# EAGLE design stepper_w_2_input_bitsB (EAGLE 6.4)
stepper conroller with 2 counting bits for unipolar stepper motor
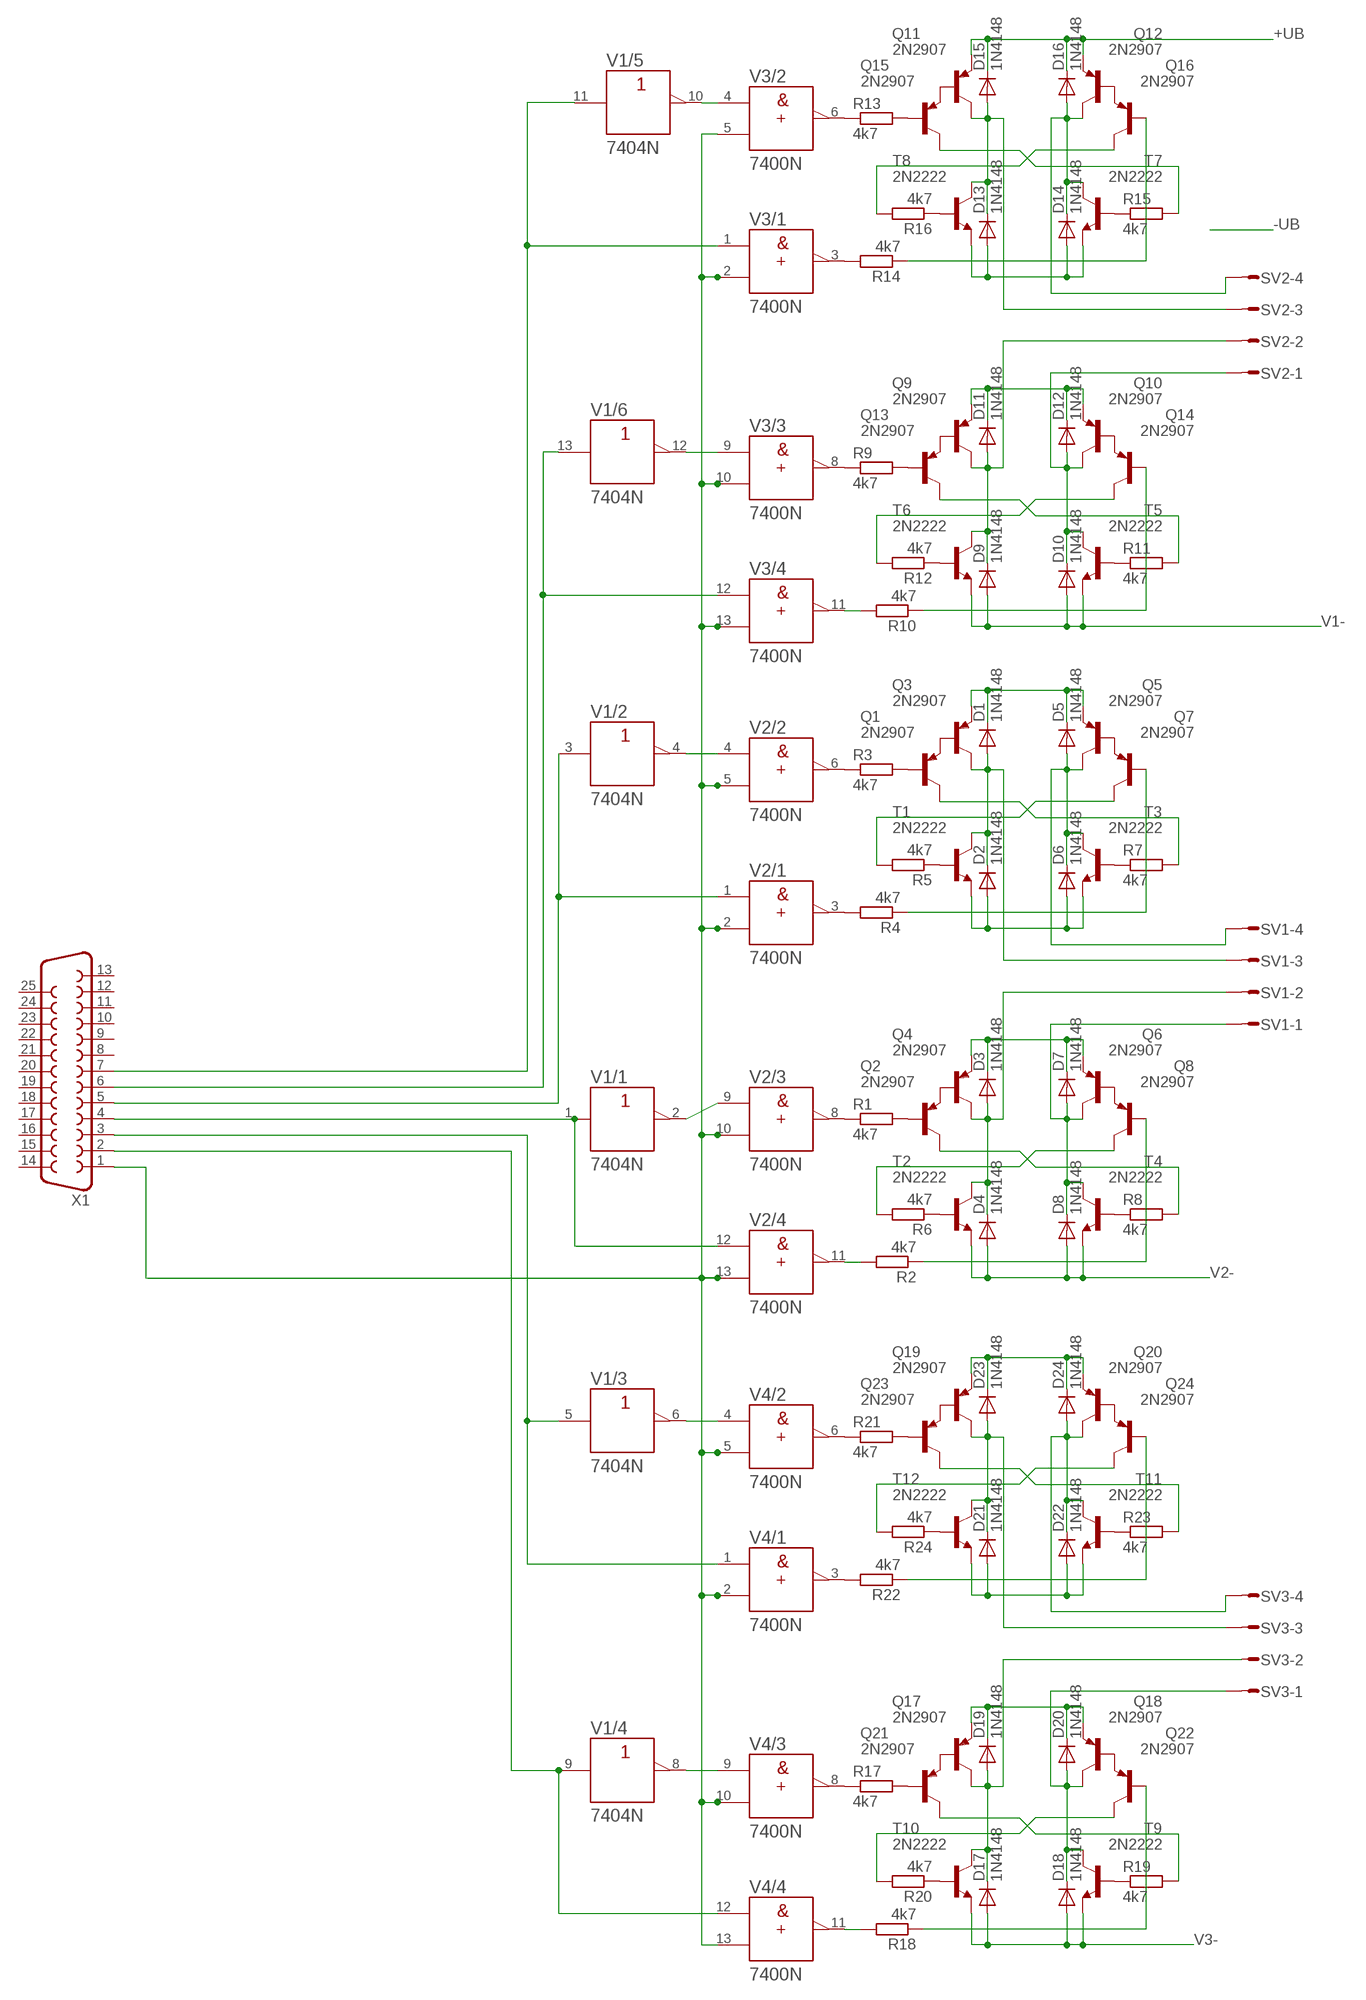
[diagram p0: schematic, sheet 1]

## Parts
D1  1N4148  DIODE-D-2.5  [D-2.5]
D2  1N4148  DIODE-D-2.5  [D-2.5]
D3  1N4148  DIODE-D-2.5  [D-2.5]
D4  1N4148  DIODE-D-2.5  [D-2.5]
D5  1N4148  DIODE-D-2.5  [D-2.5]
D6  1N4148  DIODE-D-2.5  [D-2.5]
D7  1N4148  DIODE-D-2.5  [D-2.5]
D8  1N4148  DIODE-D-2.5  [D-2.5]
D9  1N4148  DIODE-D-2.5  [D-2.5]
D10  1N4148  DIODE-D-2.5  [D-2.5]
D11  1N4148  DIODE-D-2.5  [D-2.5]
D12  1N4148  DIODE-D-2.5  [D-2.5]
D13  1N4148  DIODE-D-2.5  [D-2.5]
D14  1N4148  DIODE-D-2.5  [D-2.5]
D15  1N4148  DIODE-D-2.5  [D-2.5]
D16  1N4148  DIODE-D-2.5  [D-2.5]
D17  1N4148  DIODE-D-2.5  [D-2.5]
D18  1N4148  DIODE-D-2.5  [D-2.5]
D19  1N4148  DIODE-D-2.5  [D-2.5]
D20  1N4148  DIODE-D-2.5  [D-2.5]
D21  1N4148  DIODE-D-2.5  [D-2.5]
D22  1N4148  DIODE-D-2.5  [D-2.5]
D23  1N4148  DIODE-D-2.5  [D-2.5]
D24  1N4148  DIODE-D-2.5  [D-2.5]
Q1  2N2907  [TO18]
Q2  2N2907  [TO18]
Q3  2N2907  [TO18]
Q4  2N2907  [TO18]
Q5  2N2907  [TO18]
Q6  2N2907  [TO18]
Q7  2N2907  [TO18]
Q8  2N2907  [TO18]
Q9  2N2907  [TO18]
Q10  2N2907  [TO18]
Q11  2N2907  [TO18]
Q12  2N2907  [TO18]
Q13  2N2907  [TO18]
Q14  2N2907  [TO18]
Q15  2N2907  [TO18]
Q16  2N2907  [TO18]
Q17  2N2907  [TO18]
Q18  2N2907  [TO18]
Q19  2N2907  [TO18]
Q20  2N2907  [TO18]
Q21  2N2907  [TO18]
Q22  2N2907  [TO18]
Q23  2N2907  [TO18]
Q24  2N2907  [TO18]
R1  4k7  R-EU_0204/7  [0204/7]
R2  4k7  R-EU_0207/10  [0207/10]
R3  4k7  R-EU_0207/10  [0207/10]
R4  4k7  R-EU_0207/10  [0207/10]
R5  4k7  R-EU_0207/10  [0207/10]
R6  4k7  R-EU_0207/10  [0207/10]
R7  4k7  R-EU_0207/10  [0207/10]
R8  4k7  R-EU_0207/10  [0207/10]
R9  4k7  R-EU_0204/7  [0204/7]
R10  4k7  R-EU_0207/10  [0207/10]
R11  4k7  R-EU_0207/10  [0207/10]
R12  4k7  R-EU_0207/10  [0207/10]
R13  4k7  R-EU_0207/10  [0207/10]
R14  4k7  R-EU_0207/10  [0207/10]
R15  4k7  R-EU_0207/10  [0207/10]
R16  4k7  R-EU_0207/10  [0207/10]
R17  4k7  R-EU_0204/7  [0204/7]
R18  4k7  R-EU_0207/10  [0207/10]
R19  4k7  R-EU_0207/10  [0207/10]
R20  4k7  R-EU_0207/10  [0207/10]
R21  4k7  R-EU_0207/10  [0207/10]
R22  4k7  R-EU_0207/10  [0207/10]
R23  4k7  R-EU_0207/10  [0207/10]
R24  4k7  R-EU_0207/10  [0207/10]
SV1  S04P  [S04P]
SV2  S04P  [S04P]
SV3  S04P  [S04P]
T1  2N2222  [TO18]
T2  2N2222  [TO18]
T3  2N2222  [TO18]
T4  2N2222  [TO18]
T5  2N2222  [TO18]
T6  2N2222  [TO18]
T7  2N2222  [TO18]
T8  2N2222  [TO18]
T9  2N2222  [TO18]
T10  2N2222  [TO18]
T11  2N2222  [TO18]
T12  2N2222  [TO18]
V1  7404N  [DIL14]
V2  7400N  [DIL14]
V3  7400N  [DIL14]
V4  7400N  [DIL14]
X1  F25HP  [F25HP]

## Nets
+UB: D1.C D3.C D5.C D7.C D11.C D12.C D15.C D16.C D19.C D20.C D23.C D24.C Q3.1(E) Q4.1(E) Q5.1(E) Q6.1(E) Q9.1(E) Q10.1(E) Q11.1(E) Q12.1(E) Q17.1(E) Q18.1(E) Q19.1(E) Q20.1(E)
N$1: R6.1 T2.2(B)
N$2: Q8.3(C) R6.2
N$3: R8.1 T4.2(B)
N$4: Q2.2(B) R1.2
N$5: Q8.2(B) R2.1
N$6: Q2.1(E) Q4.2(B)
N$7: Q2.3(C) R8.2
N$8: Q6.2(B) Q8.1(E)
N$9: D3.A D4.C Q4.3(C) SV1.2 T2.3(C)
N$10: D7.A D8.C Q6.3(C) SV1.1 T4.3(C)
N$11: R1.1 V2.8(/3:Y)
N$12: R2.2 V2.11(/4:Y)
N$13: Q7.3(C) R5.2
N$14: V1.4(/2:Y) V2.4(/2:A)
N$15: Q7.2(B) R4.1
N$16: R5.1 T1.2(B)
N$17: Q1.3(C) R7.2
N$18: R7.1 T3.2(B)
N$19: D1.A D2.C Q3.3(C) SV1.3 T1.3(C)
N$20: D5.A D6.C Q5.3(C) SV1.4 T3.3(C)
N$21: Q1.1(E) Q3.2(B)
N$22: Q5.2(B) Q7.1(E)
N$23: R4.2 V2.3(/1:Y)
N$24: R3.1 V2.6(/2:Y)
N$25: V1.3(/2:A) V2.1(/1:A) X1.5
N$26: Q1.2(B) R3.2
N$27: V1.2(/1:Y) V2.9(/3:A)
N$28: V1.1(/1:A) V2.12(/4:A) X1.4
N$29: Q14.3(C) R12.2
N$30: Q14.2(B) R10.1
N$31: Q13.3(C) R11.2
N$32: D9.C D11.A Q9.3(C) SV2.2 T6.3(C)
N$33: D10.C D12.A Q10.3(C) SV2.1 T5.3(C)
N$34: R9.1 V3.8(/3:Y)
N$35: R10.2 V3.11(/4:Y)
N$36: Q16.3(C) R16.2
N$37: Q16.2(B) R14.1
N$38: Q15.3(C) R15.2
N$39: D13.C D15.A Q11.3(C) SV2.3 T8.3(C)
N$40: D14.C D16.A Q12.3(C) SV2.4 T7.3(C)
N$41: R14.2 V3.3(/1:Y)
N$42: R13.1 V3.6(/2:Y)
N$43: R12.1 T6.2(B)
N$44: R11.1 T5.2(B)
N$45: Q9.2(B) Q13.1(E)
N$46: Q10.2(B) Q14.1(E)
N$47: R16.1 T8.2(B)
N$48: R15.1 T7.2(B)
N$49: Q11.2(B) Q15.1(E)
N$50: Q12.2(B) Q16.1(E)
N$51: Q15.2(B) R13.2
N$52: V1.10(/5:Y) V3.4(/2:A)
N$53: V1.11(/5:A) V3.1(/1:A) X1.7
N$54: Q22.3(C) R20.2
N$55: V1.13(/6:A) V3.12(/4:A) X1.6
N$56: Q13.2(B) R9.2
N$57: Q22.2(B) R18.1
N$58: Q21.3(C) R19.2
N$59: D17.C D19.A Q17.3(C) T10.3(C)
N$60: D18.C D20.A Q18.3(C) SV3.1 T9.3(C)
N$61: R17.1 V4.8(/3:Y)
N$62: R18.2 V4.11(/4:Y)
N$63: Q24.3(C) R24.2
N$64: Q24.2(B) R22.1
N$65: Q23.3(C) R23.2
N$66: D21.C D23.A Q19.3(C) SV3.3 T12.3(C)
N$67: D22.C D24.A Q20.3(C) SV3.4 T11.3(C)
N$68: R22.2 V4.3(/1:Y)
N$69: R21.1 V4.6(/2:Y)
N$70: R20.1 T10.2(B)
N$71: R19.1 T9.2(B)
N$72: Q17.2(B) Q21.1(E)
N$73: Q18.2(B) Q22.1(E)
N$74: R24.1 T12.2(B)
N$75: R23.1 T11.2(B)
N$76: Q19.2(B) Q23.1(E)
N$77: Q20.2(B) Q24.1(E)
N$78: Q23.2(B) R21.2
N$79: V1.6(/3:Y) V4.4(/2:A)
N$80: V1.5(/3:A) V4.1(/1:A) X1.3
N$81: V1.12(/6:Y) V3.9(/3:A)
N$82: V1.9(/4:A) V4.12(/4:A) X1.2
N$83: Q21.2(B) R17.2
N$85: V1.8(/4:Y) V4.9(/3:A)
STROBE: V2.2(/1:B) V2.5(/2:B) V2.10(/3:B) V2.13(/4:B) V3.2(/1:B) V3.5(/2:B) V3.10(/3:B) V3.13(/4:B) V4.2(/1:B) V4.5(/2:B) V4.10(/3:B) V4.13(/4:B) X1.1
V1-: D9.A D10.A D13.A D14.A T5.1(E) T6.1(E) T7.1(E) T8.1(E)
V2-: D2.A D4.A D6.A D8.A T1.1(E) T2.1(E) T3.1(E) T4.1(E)
V3-: D17.A D18.A D21.A D22.A T9.1(E) T10.1(E) T11.1(E) T12.1(E)
Unconnected: SV3.2 X1.8 X1.9 X1.10 X1.11 X1.12 X1.13 X1.14 X1.15 X1.16 X1.17 X1.18 X1.19 X1.20 X1.21 X1.22 X1.23 X1.24 X1.25

## Power pins joined to a net without a drawn wire
+UB: V1.14(/+UB:+UB) V2.14(/+UB:+UB) V3.14(/+UB:+UB) V4.14(/+UB:+UB)
-UB: V1.7(/-UB:-UB) V2.7(/-UB:-UB) V3.7(/-UB:-UB) V4.7(/-UB:-UB)

## Library data of the parts
D1-D24 = diode:DIODE-: DIODE
Q1-Q24 = transistor-pnp:2N2907*: PNP Transistor
R1-R24 = rcl:R-EU_: RESISTOR, European symbol
SV1-SV3 = con-amp-mt:S04P: AMP MT CONNECTOR; OC_FARNELL: unknown; OC_NEWARK: unknown
T1-T12 = transistor:2N2222: NPN TRANSISTOR
V1 = 74ttl-din:74*04: Hex INVERTER
V2-V4 = 74ttl-din:74*00: Quad 2-input NAND gate
X1 = con-subd:F25: SUB-D; OC_FARNELL: unknown; OC_NEWARK: unknown

## Board
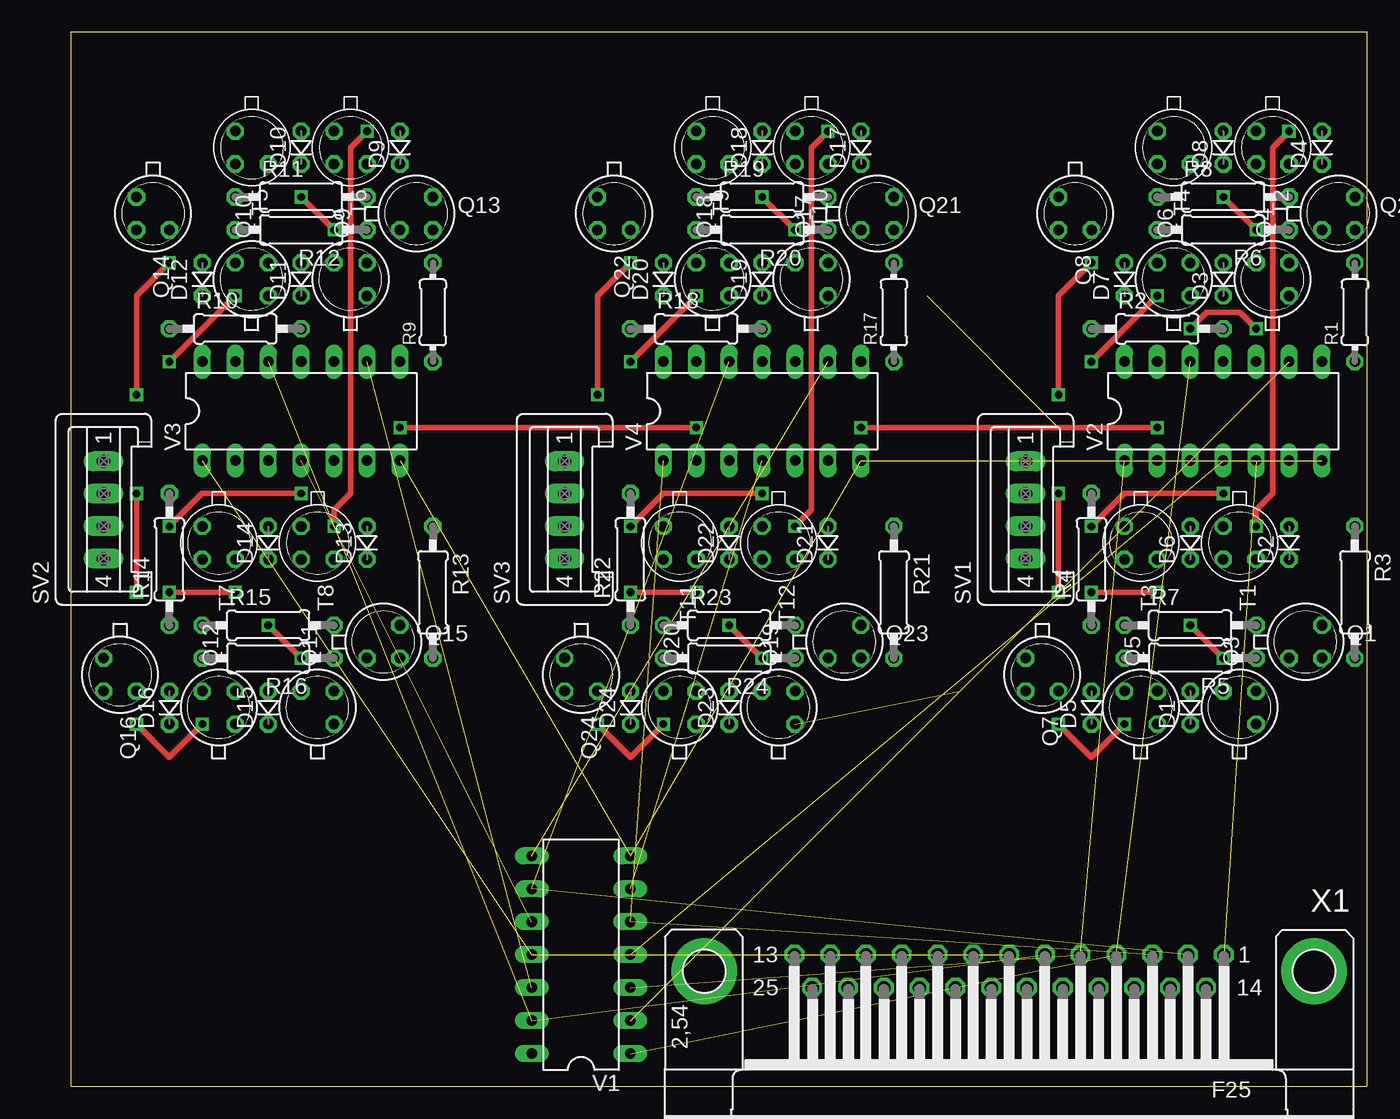
[diagram p1: board, top side]
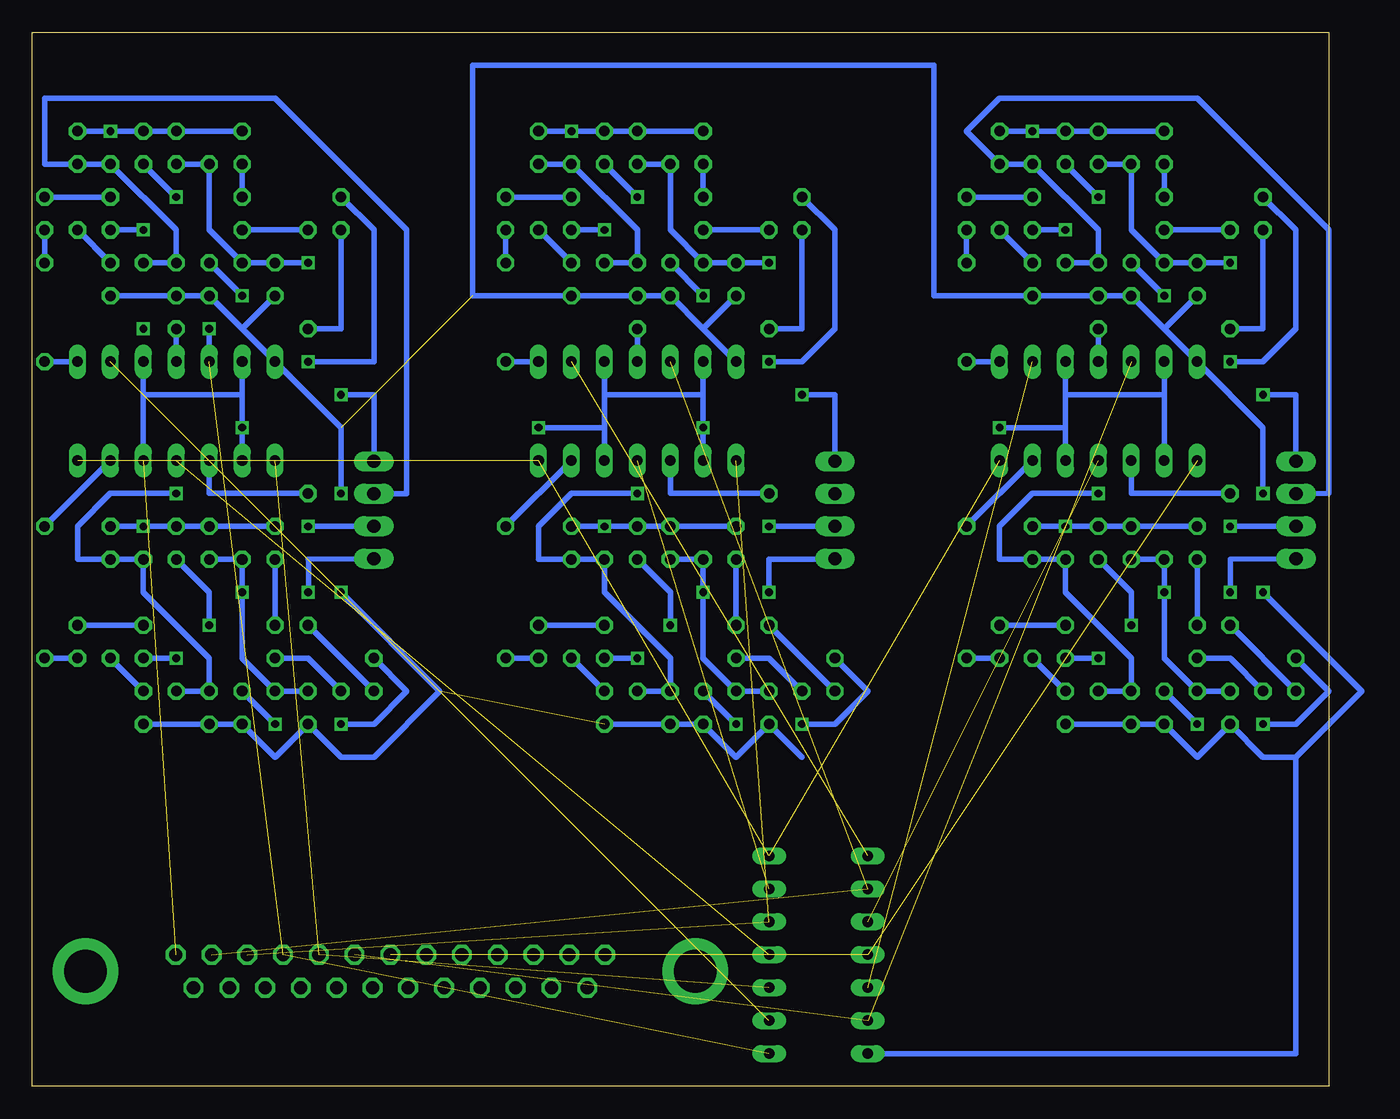
[diagram p2: board, bottom side, seen from below]

Size 100 x 81.27 mm. Coordinates in mm from the lower left corner, seen from the top.
Outline: 0,0 100,0 100,81.27 0,81.27 0,0
Copper layers (1*16): Top 0.035mm / dielectric 1.5mm / Bottom 0.035mm
Design rules "default": minimum track width 10mil, minimum drill 24mil, track to track 8mil, track to pad 8mil, pad to pad 8mil, via to via 8mil, smd to smd 8mil, copper to edge 40mil, drill to drill 8mil, minimum pad ring 10mil, minimum via ring 8mil, stop-mask expansion 4mil, vias tented up to drill 0mil, thermal gap 10mil

### Footprints (pad centres in the part's own frame; a part is rotated, then mirrored left to right if it is on the bottom)
D-2.5 = drill 0.813 octagon: A 1.27,0; C -1.27,0
TO18 = drill 0.813 octagon: 1 -1.27,-1.27; 2 1.27,-1.27; 3 1.27,1.27
0204/7 = drill 0.813 octagon: 1 -3.81,0; 2 3.81,0
0207/10 = drill 0.813 octagon: 1 -5.08,0; 2 5.08,0
S04P = drill 1.016 long: 1 3.75,0; 2 1.25,0; 3 -1.25,0; 4 -3.75,0
DIL14 = drill 0.813 long: 1 -7.62,-3.81; 2 -5.08,-3.81; 3 -2.54,-3.81; 4 0,-3.81; 5 2.54,-3.81; 6 5.08,-3.81; 7 7.62,-3.81; 8 7.62,3.81; 9 5.08,3.81; 10 2.54,3.81; 11 0,3.81; 12 -2.54,3.81; 13 -5.08,3.81; 14 -7.62,3.81
F25HP = drill 1.016 octagon: 1 -16.561,-1.27; 2 -13.792,-1.27; 3 -11.049,-1.27; 4 -8.28,-1.27; 5 -5.512,-1.27; 6 -2.769,-1.27; 7 0,-1.27; 8 2.769,-1.27; 9 5.512,-1.27; 10 8.28,-1.27; 11 11.049,-1.27; 12 13.792,-1.27; 13 16.561,-1.27; 14 -15.189,1.27; 15 -12.421,1.27; 16 -9.652,1.27; 17 -6.909,1.27; 18 -4.14,1.27; 19 -1.372,1.27; 20 1.372,1.27; 21 4.14,1.27; 22 6.909,1.27; 23 9.652,1.27; 24 12.421,1.27; 25 15.189,1.27 | drill 3.302 pad 5.08: G1 -23.52,0; G2 23.52,0

### Placement (x,y rotation side)
D1  86.36,29.21 90 top
D2  93.98,41.91 90 top
D3  88.9,62.23 90 top
D4  96.52,72.39 90 top
D5  78.74,29.21 90 top
D6  86.36,41.91 90 top
D7  81.28,62.23 90 top
D8  88.9,72.39 90 top
D9  25.4,72.39 90 top
D10  17.78,72.39 90 top
D11  17.78,62.23 90 top
D12  10.16,62.23 90 top
D13  22.86,41.91 90 top
D14  15.24,41.91 90 top
D15  15.24,29.21 90 top
D16  7.62,29.21 90 top
D17  60.96,72.39 90 top
D18  53.34,72.39 90 top
D19  53.34,62.23 90 top
D20  45.72,62.23 90 top
D21  58.42,41.91 90 top
D22  50.8,41.91 90 top
D23  50.8,29.21 90 top
D24  43.18,29.21 90 top
Q1  95.25,34.29 0 top
Q2  97.79,67.31 0 top
Q3  90.17,29.21 90 top
Q4  92.71,62.23 90 top
Q5  82.55,29.21 90 top
Q6  85.09,62.23 90 top
Q7  74.93,31.75 270 top
Q8  77.47,67.31 270 top
Q9  21.59,62.23 90 top
Q10  13.97,62.23 90 top
Q11  19.05,29.21 90 top
Q12  11.43,29.21 90 top
Q13  26.67,67.31 0 top
Q14  6.35,67.31 270 top
Q15  24.13,34.29 0 top
Q16  3.81,31.75 270 top
Q17  57.15,62.23 90 top
Q18  49.53,62.23 90 top
Q19  54.61,29.21 90 top
Q20  46.99,29.21 90 top
Q21  62.23,67.31 0 top
Q22  41.91,67.31 270 top
Q23  59.69,34.29 0 top
Q24  39.37,31.75 270 top
R1  99.06,59.69 90 top
R2  83.82,58.42 0 top
R3  99.06,38.1 270 top
R4  78.74,40.64 90 top
R5  86.36,33.02 180 top
R6  88.9,66.04 180 top
R7  86.36,35.56 0 top
R8  88.9,68.58 0 top
R9  27.94,59.69 90 top
R10  12.7,58.42 0 top
R11  17.78,68.58 0 top
R12  17.78,66.04 180 top
R13  27.94,38.1 270 top
R14  7.62,40.64 90 top
R15  15.24,35.56 0 top
R16  15.24,33.02 180 top
R17  63.5,59.69 90 top
R18  48.26,58.42 0 top
R19  53.34,68.58 0 top
R20  53.34,66.04 180 top
R21  63.5,38.1 270 top
R22  43.18,40.64 90 top
R23  50.8,35.56 0 top
R24  50.8,33.02 180 top
SV1  73.66,44.45 90 top
SV2  2.54,44.45 90 top
SV3  38.1,44.45 90 top
T1  90.17,41.91 270 top
T2  92.71,72.39 270 top
T3  82.55,41.91 270 top
T4  85.09,72.39 270 top
T5  13.97,72.39 270 top
T6  21.59,72.39 270 top
T7  11.43,41.91 270 top
T8  19.05,41.91 270 top
T9  49.53,72.39 270 top
T10  57.15,72.39 270 top
T11  46.99,41.91 270 top
T12  54.61,41.91 270 top
V1  39.37,10.16 90 top
V2  88.9,52.07 0 top
V3  17.78,52.07 0 top
V4  53.34,52.07 0 top
X1  72.39,8.89 180 top

### Tracks (layer width: path | path; a pad name or v marks a point on that pad's centre or on a via)
+UB  (via drill 0.6)  (2 unrouted)
  Top 0.406: v76.2,45.72 v76.2,38.1 | v5.08,38.1 v5.08,45.72
  Bottom 0.406: D1.C Q3.1 Q5.1 81.28,25.4 D5.C 76.2,25.4 73.66,25.4 68.58,30.48 v76.2,38.1 | Q4.1 D3.C Q6.1 83.82,58.42 | D7.C 83.82,58.42 | 83.82,58.42 V2.14 76.2,50.8 v76.2,45.72 | D12.C 12.7,58.42 | 12.7,58.42 Q10.1 D11.C Q9.1 30.48,60.96 30.48,78.74 66.04,78.74 66.04,60.96 Q17.1 D19.C Q18.1 48.26,58.42 | Q11.1 D15.C Q12.1 10.16,25.4 D16.C 5.08,25.4 2.54,25.4 | 2.54,25.4 -2.54,30.48 v5.08,38.1 | v5.08,45.72 5.08,50.8 V3.14 12.7,58.42 | D20.C 48.26,58.42 | 48.26,58.42 V4.14 | Q19.1 D23.C Q20.1 45.72,25.4 D24.C 40.64,25.4 | V1.14 2.54,2.54 2.54,25.4
-UB  (3 unrouted)
N$1  (via drill 0.6)
  Top 0.406: v91.44,66.04 v88.9,68.58
  Bottom 0.406: R6.1 v91.44,66.04 | v88.9,68.58 T2.2
N$2
  Bottom 0.406: Q8.3 R6.2
N$3
  Bottom 0.406: R8.1 T4.2
N$4
  Bottom 0.406: R1.2 Q2.2
N$5
  Bottom 0.406: Q8.2 76.2,58.42 R2.1
N$6
  Bottom 0.406: Q4.2 Q2.1
N$7
  Bottom 0.406: Q2.3 R8.2
N$8  (via drill 0.6)
  Top 0.406: v83.82,60.96 v78.74,55.88
  Bottom 0.406: v78.74,55.88 73.66,55.88 73.66,66.04 Q8.1 | Q6.2 v83.82,60.96
N$9
  Bottom 0.406: Q4.3 D3.A 88.9,66.04 T2.3 D4.C 99.06,71.12 99.06,76.2 81.28,76.2 71.12,66.04 71.12,45.72 71.14,45.7 SV1.2
N$10  (via drill 0.6)
  Top 0.406: v78.74,63.5 76.2,60.96 v76.2,53.34
  Bottom 0.406: D8.C T4.3 86.36,66.04 Q6.3 D7.A v78.74,63.5 | v76.2,53.34 73.66,53.34 SV1.1
N$11
  Bottom 0.406: R1.1 V2.8
N$12
  Bottom 0.406: V2.11 R2.2
N$13
  Bottom 0.406: Q7.3 78.74,33.02 R5.2
N$14  (1 unrouted)
N$15
  Bottom 0.406: R4.1 Q7.2
N$16  (via drill 0.6)
  Top 0.406: v88.9,33.02 v86.36,35.56
  Bottom 0.406: R5.1 v88.9,33.02 | v86.36,35.56 86.36,38.1 T1.2
N$17
  Bottom 0.406: Q1.3 R7.2
N$18
  Bottom 0.406: R7.1 T3.2
N$19  (via drill 0.6)
  Top 0.406: v78.74,43.18 81.28,45.72 v88.9,45.72
  Bottom 0.406: Q3.3 D1.A 86.36,33.02 91.44,38.1 T1.3 D2.C 96.52,40.64 96.52,43.18 93.98,45.72 v88.9,45.72 | SV1.3 76.18,43.2 v78.74,43.18
N$20  (via drill 0.6)
  Top 0.406: v78.74,38.1 v83.82,38.1
  Bottom 0.406: D5.A Q5.3 83.82,33.02 v83.82,38.1 T3.3 D6.C | SV1.4 78.74,40.64 78.68,40.58 78.68,38.16 v78.74,38.1
N$21
  Bottom 0.406: Q3.2 Q1.1
N$22  (via drill 0.6)
  Top 0.406: v81.28,27.94 78.74,25.4 v76.2,27.94
  Bottom 0.406: Q5.2 v81.28,27.94 | Q7.1 71.12,30.48 73.66,27.94 v76.2,27.94
N$23
  Bottom 0.406: R4.2 86.36,45.72 V2.3
N$24
  Bottom 0.406: R3.1 V2.6
N$25  (2 unrouted)
N$26
  Bottom 0.406: R3.2 Q1.2
N$27  (1 unrouted)
N$28  (via drill 0.6)  (2 unrouted)
  Top 0.406: v91.44,58.42 90.17,59.69 87.63,59.69 v86.36,58.42
  Bottom 0.406: v86.36,58.42 V2.12
N$29
  Bottom 0.406: Q14.3 R12.2
N$30
  Bottom 0.406: Q14.2 5.08,58.42 R10.1
N$31
  Bottom 0.406: Q13.3 R11.2
N$32
  Bottom 0.406: Q9.3 D11.A 17.78,66.04 T6.3 D9.C 27.94,73.66 25.4,76.2 10.16,76.2 0,66.04 0,45.72 SV2.2
N$33  (via drill 0.6)
  Top 0.406: v5.08,53.34 5.08,60.96 v7.62,63.5
  Bottom 0.406: D10.C T5.3 15.24,66.04 Q10.3 D12.A v7.62,63.5 | SV2.1 2.54,53.34 v5.08,53.34
N$34
  Bottom 0.406: R9.1 V3.8
N$35
  Bottom 0.406: R10.2 V3.11
N$36
  Bottom 0.406: Q16.3 7.62,33.02 R16.2
N$37
  Bottom 0.406: Q16.2 R14.1
N$38
  Bottom 0.406: R15.2 Q15.3
N$39  (via drill 0.6)
  Top 0.406: v7.62,43.18 10.16,45.72 v17.78,45.72
  Bottom 0.406: Q11.3 D15.A 15.24,33.02 20.32,38.1 T8.3 D13.C 25.4,40.64 25.4,43.18 22.86,45.72 v17.78,45.72 | SV2.3 v7.62,43.18
N$40  (via drill 0.6)
  Top 0.406: v7.62,38.1 v12.7,38.1
  Bottom 0.406: D16.A Q12.3 12.7,33.02 v12.7,38.1 T7.3 D14.C | SV2.4 7.62,40.64 v7.62,38.1
N$41
  Bottom 0.406: R14.2 15.24,45.72 V3.3
N$42
  Bottom 0.406: R13.1 V3.6
N$43  (via drill 0.6)
  Top 0.406: v17.78,68.58 v20.32,66.04
  Bottom 0.406: T6.2 v17.78,68.58 | v20.32,66.04 R12.1
N$44
  Bottom 0.406: R11.1 T5.2
N$45
  Bottom 0.406: Q13.1 Q9.2
N$46  (via drill 0.6)
  Top 0.406: v7.62,55.88 v12.7,60.96
  Bottom 0.406: Q14.1 2.54,66.04 2.54,58.42 5.08,55.88 v7.62,55.88 | v12.7,60.96 Q10.2
N$47  (via drill 0.6)
  Top 0.406: v15.24,35.56 v17.78,33.02
  Bottom 0.406: T8.2 15.24,38.1 v15.24,35.56 | v17.78,33.02 R16.1
N$48
  Bottom 0.406: R15.1 T7.2
N$49
  Bottom 0.406: Q11.2 Q15.1
N$50  (via drill 0.6)
  Top 0.406: v5.08,27.94 7.62,25.4 v10.16,27.94
  Bottom 0.406: Q16.1 0,30.48 2.54,27.94 v5.08,27.94 | v10.16,27.94 Q12.2
N$51
  Bottom 0.406: Q15.2 R13.2
N$52  (1 unrouted)
N$53  (2 unrouted)
N$54
  Bottom 0.406: Q22.3 R20.2
N$55  (2 unrouted)
N$56
  Bottom 0.406: Q13.2 R9.2
N$57
  Bottom 0.406: Q22.2 40.64,58.42 R18.1
N$58
  Bottom 0.406: R19.2 Q21.3
N$59
  Bottom 0.406: D17.C T10.3 53.34,66.04 D19.A Q17.3
N$60  (via drill 0.6)
  Top 0.406: v43.18,63.5 40.64,60.96 v40.64,53.34
  Bottom 0.406: D18.C T9.3 50.8,66.04 Q18.3 D20.A v43.18,63.5 | v40.64,53.34 38.1,53.34 SV3.1
N$61
  Bottom 0.406: V4.8 R17.1
N$62
  Bottom 0.406: R18.2 V4.11
N$63
  Bottom 0.406: Q24.3 43.18,33.02 R24.2
N$64
  Bottom 0.406: R22.1 Q24.2
N$65
  Bottom 0.406: Q23.3 R23.2
N$66  (via drill 0.6)
  Top 0.406: v43.18,43.18 45.72,45.72 v53.34,45.72
  Bottom 0.406: Q19.3 D23.A 50.8,33.02 55.88,38.1 T12.3 D21.C 60.96,40.64 60.96,43.18 58.42,45.72 v53.34,45.72 | SV3.3 43.16,43.2 v43.18,43.18
N$67  (via drill 0.6)
  Top 0.406: v48.26,38.1 v43.18,38.1
  Bottom 0.406: D22.C T11.3 v48.26,38.1 48.26,33.02 Q20.3 D24.A | v43.18,38.1 43.18,40.64 38.1,40.64 SV3.4
N$68
  Bottom 0.406: V4.3 50.8,45.72 R22.2
N$69
  Bottom 0.406: R21.1 V4.6
N$70  (via drill 0.6)
  Top 0.406: v53.34,68.58 v55.88,66.04
  Bottom 0.406: T10.2 v53.34,68.58 | v55.88,66.04 R20.1
N$71
  Bottom 0.406: T9.2 R19.1
N$72
  Bottom 0.406: Q21.1 Q17.2
N$73  (via drill 0.6)
  Top 0.406: v43.18,55.88 v48.26,60.96
  Bottom 0.406: Q22.1 38.1,66.04 38.1,58.42 40.64,55.88 v43.18,55.88 | v48.26,60.96 Q18.2
N$74  (via drill 0.6)
  Top 0.406: v53.34,33.02 v50.8,35.56
  Bottom 0.406: R24.1 v53.34,33.02 | v50.8,35.56 50.8,38.1 T12.2
N$75
  Bottom 0.406: R23.1 T11.2
N$76
  Bottom 0.406: Q19.2 Q23.1
N$77  (via drill 0.6)
  Top 0.406: v40.64,27.94 43.18,25.4 v45.72,27.94
  Bottom 0.406: Q24.1 35.56,30.48 38.1,27.94 v40.64,27.94 | v45.72,27.94 Q20.2
N$78
  Bottom 0.406: Q23.2 R21.2
N$79  (1 unrouted)
N$80  (2 unrouted)
N$81  (1 unrouted)
N$82  (2 unrouted)
N$83
  Bottom 0.406: Q21.2 R17.2
N$85  (1 unrouted)
STROBE  (via drill 0.6)  (1 unrouted)
  Top 0.406: v25.4,50.8 v48.26,50.8 | v83.82,50.8 v60.96,50.8
  Bottom 0.406: V3.2 12.7,53.34 | V3.13 12.7,53.34 | 12.7,53.34 20.32,53.34 | V3.10 20.32,53.34 | 20.32,50.8 V3.5 | V4.13 48.26,53.34 | 48.26,53.34 55.88,53.34 V4.10 55.88,50.8 | 55.88,50.8 V4.5 | 83.82,53.34 v83.82,50.8 V2.2 | 83.82,53.34 V2.13 | 91.44,53.34 V2.10 | V2.5 91.44,53.34 | 91.44,53.34 83.82,53.34 | 20.32,53.34 20.32,50.8 | 20.32,50.8 v25.4,50.8 | 48.26,53.34 v48.26,50.8 V4.2 | v60.96,50.8 55.88,50.8
V1-  (via drill 0.6)
  Top 0.406: v20.32,43.18 20.32,44.45 21.59,45.72 21.59,72.39 v22.86,73.66
  Bottom 0.406: T5.1 D10.A T6.1 v22.86,73.66 D9.A | D13.A v20.32,43.18 T8.1 D14.A T7.1
V2-  (via drill 0.6)
  Top 0.406: v91.44,43.18 91.44,44.45 92.71,45.72 92.71,72.39 v93.98,73.66
  Bottom 0.406: D4.A v93.98,73.66 T2.1 D8.A T4.1 | T3.1 D6.A T1.1 v91.44,43.18 D2.A
V3-  (via drill 0.6)
  Top 0.406: v58.42,73.66 57.15,72.39 57.15,44.45 v55.88,43.18
  Bottom 0.406: T9.1 D18.A T10.1 v58.42,73.66 D17.A | D21.A v55.88,43.18 T12.1 D22.A T11.1